# EAGLE design NEW5V (EAGLE 8.5.0)
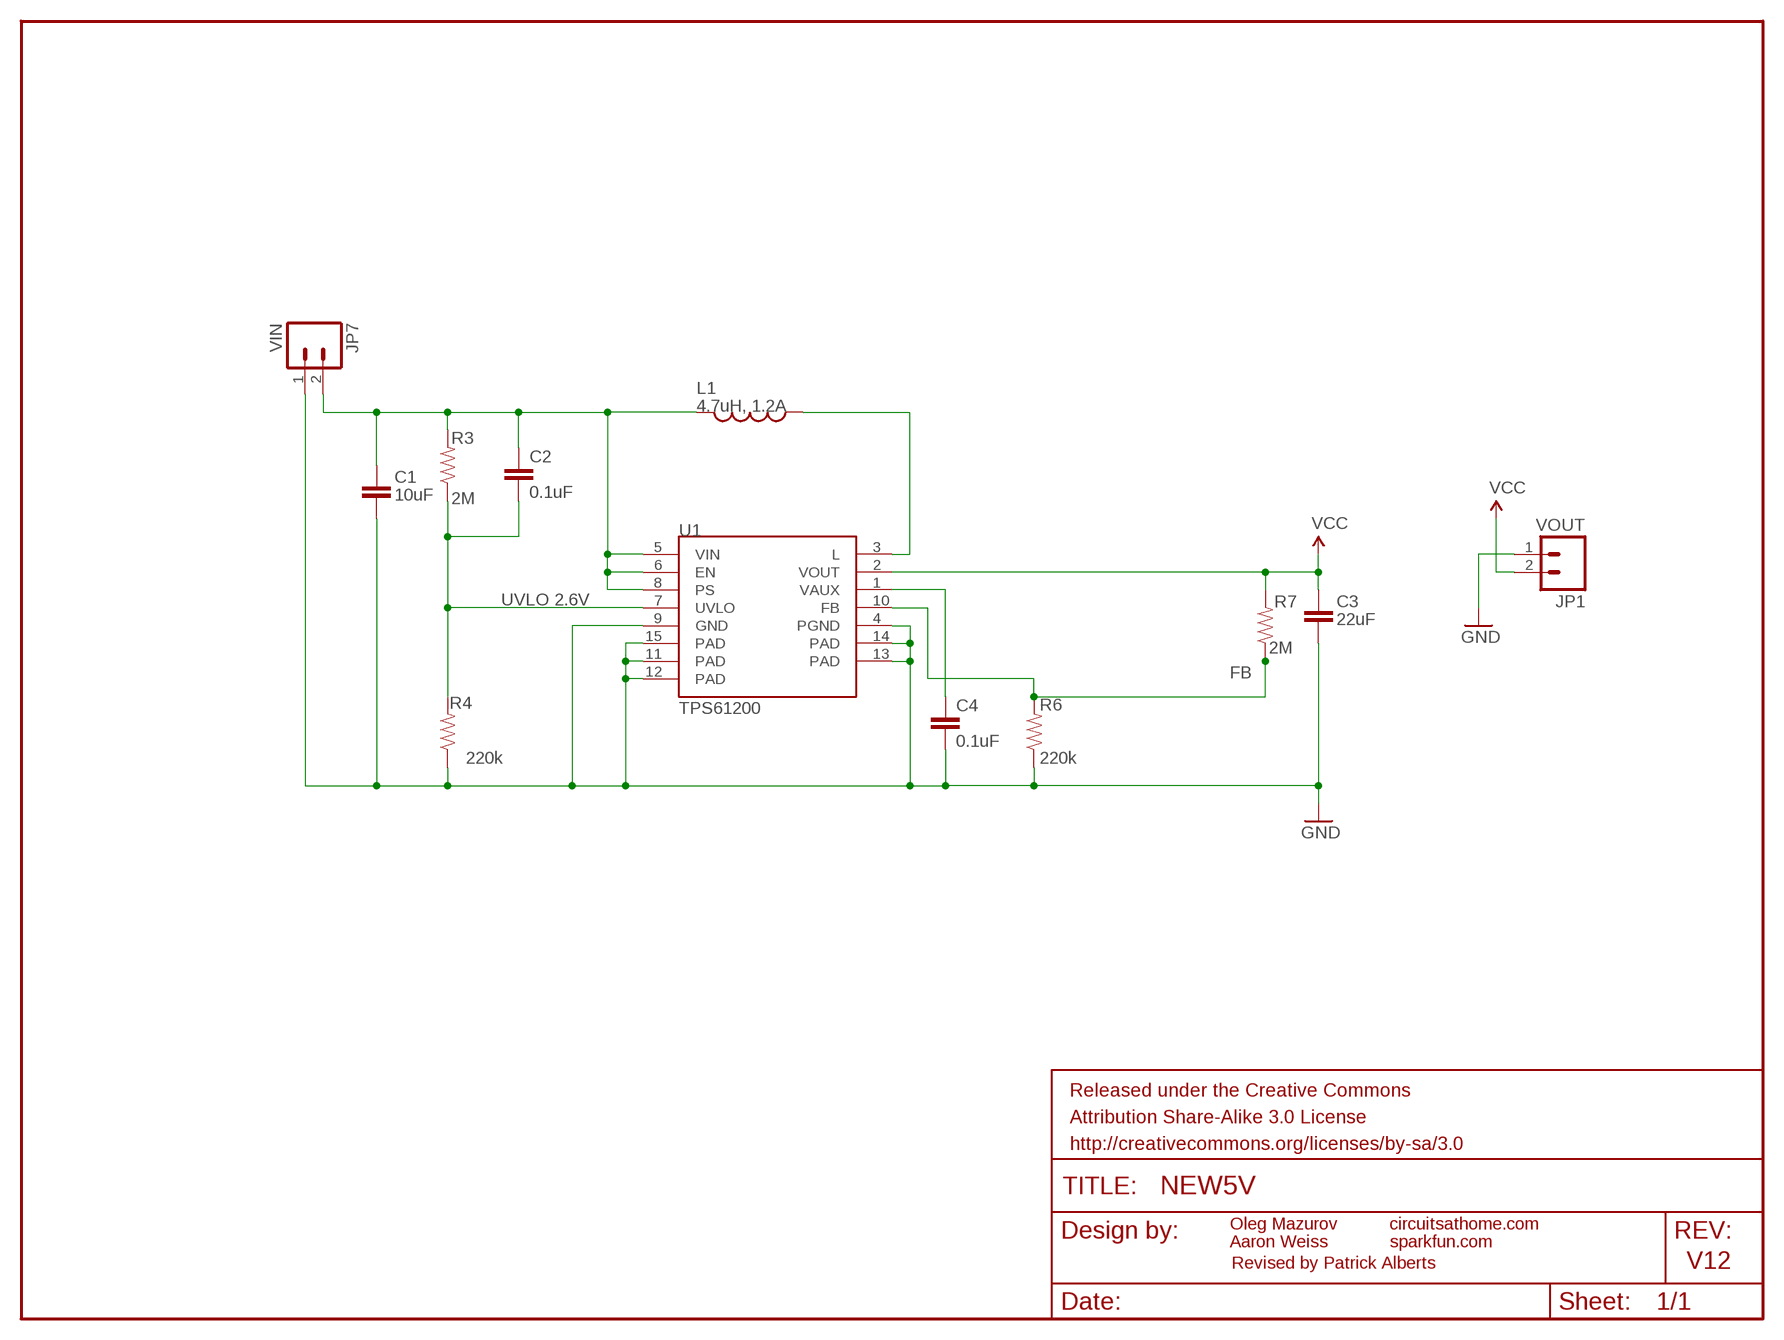
[diagram p0: schematic, sheet 1]

## Parts
C1  10uF  CAP1206  [1206]
C2  0.1uF  CAP0603-CAP  [0603-CAP]
C3  22uF  CAP0805  [0805]
C4  0.1uF  CAP0603-CAP  [0603-CAP]
FRAME1  FRAME-LETTER  [CREATIVE_COMMONS]
JP1  VOUT  M02PTH  [1X02]
JP7  VIN  M02PTH  [1X02]
L1  4.7uH, 1.2A  INDUCTOR.  [CDRH2D09]
R3  2M  RESISTOR0603-RES  [0603-RES]
R4  220k  RESISTOR0603-RES  [0603-RES]
R6  220k  RESISTOR0603-RES  [0603-RES]
R7  2M  RESISTOR0603-RES  [0603-RES]
U1  TPS61200  [QFN-10_PAD]

## Nets
FB: R6.2 R7.1 U1.10(FB)
GND: C1.2 C3.2 C4.2 JP1.1 JP7.1 R4.1 R6.1 U1.4(PGND) U1.9(GND) U1.11(PAD) U1.12(PAD) U1.13(PAD) U1.14(PAD) U1.15(PAD)
N$1: C4.1 U1.1(VAUX)
N$2: L1.P$1 U1.3(L)
UVLO: C2.2 R3.1 R4.2 U1.7(UVLO)
VCC: C3.1 JP1.2 R7.2 U1.2(VOUT)
VIN: C1.1 C2.1 JP7.2 L1.P$2 R3.2 U1.5(VIN) U1.6(EN) U1.8(PS)

## Notes on the sheet
- UVLO 2.6V
- Oleg Mazurov | circuitsathome.com
- Aaron Weiss | sparkfun.com
- Revised by Patrick Alberts | V12

## Library data of the parts
C1 C3 = CH_passive:CAP: Capacitor Standard 0603 ceramic capacitor, and 0.1" leaded capacitor.
C2 C4 = SparkFun:CAP: Capacitor Standard 0603 ceramic capacitor, and 0.1" leaded capacitor.
FRAME1 = SparkFun-Aesthetics:FRAME-LETTER: Schematic Frame Standard 8.5x11 US Letter frame
JP1 JP7 = SparkFun:M02: Header 2 Standard 2-pin 0.1" header. Use with straight break away headers (SKU : PRT-00116), right angle break away headers (PRT-00553), swiss pins (PRT-00743), machine pins (PRT-00117), and female headers (PRT-00115). Molex polarized connector foot print use with SKU : PRT-08233 with associated crimp pins and housings.
L1 = SparkFun:INDUCTOR: Inductors Basic Inductor/Choke - 0603 and 1206. Footprints are not proven and vary greatly between part numbers.
R3 R4 R6 R7 = SparkFun:RESISTOR: Resistor Basic schematic elements and footprints for 0603, 1206, and PTH resistors.
U1 = SparkFun:TPS61200: DC to DC Booster

## Board
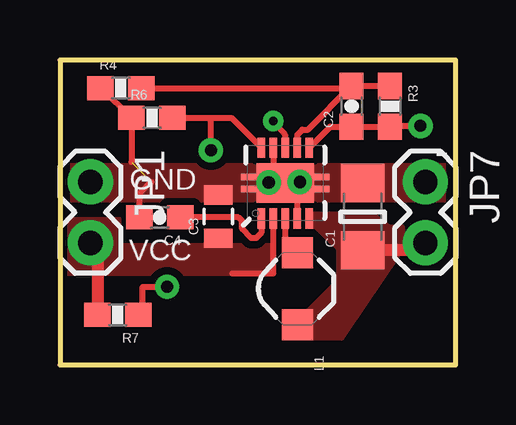
[diagram p1: board, top side]
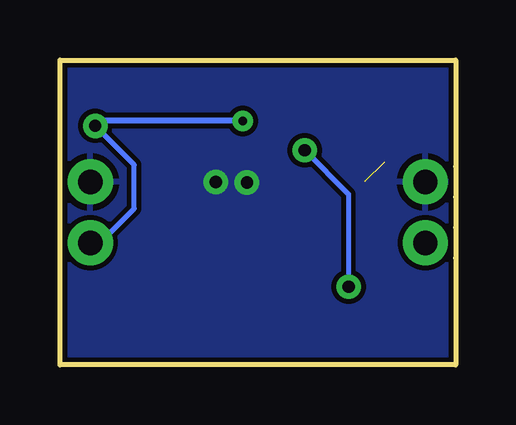
[diagram p2: board, bottom side, seen from below]

Size 16.51 x 12.7 mm. Coordinates in mm from the lower left corner, seen from the top.
Outline: 0,0 16.51,0 16.51,12.7 0,12.7 0,0
Copper layers (1*16): Top 0.035mm / dielectric 1.5mm / Bottom 0.035mm
Design rules "SparkFun *": minimum track width 6mil, minimum drill 10mil, track to track 8mil, track to pad 8mil, pad to pad 8mil, via to via 8mil, smd to smd 8mil, copper to edge 8mil, drill to drill 8mil, minimum pad ring 12mil, minimum via ring 10mil, stop-mask expansion 4mil, vias tented up to drill 20mil, thermal gap 10mil

### Footprints (pad centres in the part's own frame; a part is rotated, then mirrored left to right if it is on the bottom)
1206 = smd 1.6 x 1.8: 1 -1.4,0; 2 1.4,0
0603-CAP = smd 1.1 x 1: 1 -0.85,0; 2 0.85,0
0805 = smd 0.8 x 1.2: 1 -0.9,0; 2 0.9,0
1X02 = drill 1.016 pad 1.88: 1 0,0; 2 2.54,0
CDRH2D09 = smd 1.3 x 1.3: P$1 -1.5,0; P$2 1.5,0
0603-RES = smd 1.1 x 1: 1 -0.85,0; 2 0.85,0
QFN-10_PAD = smd 0.297 x 0.85: 1 -1,-1.475; 2 -0.5,-1.475; 3 0,-1.475; 4 0.5,-1.475; 5 1,-1.475; 6 1,1.475; 7 0.5,1.475; 8 0,1.475; 9 -0.5,1.475; 10 -1,1.475 | smd 0.7 x 0.28: 11 -1.5,0.25; 12 -1.5,-0.25; 13 1.5,0.25; 14 1.5,-0.25 | smd 2.4 x 1.65: 15 0,0

### Placement (x,y rotation side)
C1  12.62,6.17 90 top
C2  12.17,10.77 90 top
C3  6.6,6.17 90 top
C4  4.17,6.15 180 top
FRAME1  21.59,-8.89 0 top  (outside the outline)
JP1  1.27,7.62 270 top
JP7  15.24,7.62 270 top
L1  9.91,3.17 270 top
R3  13.77,10.77 270 top
R4  2.54,11.53 0 top
R6  3.84,10.29 0 top
R7  2.41,2.08 180 top
U1  9.4,7.57 0 top

### Tracks (layer width: path | path; a pad name or v marks a point on that pad's centre or on a via)
FB  (via drill 0.51)
  Top 0.254: U1.10 7.16,10.29 6.35,10.29 | R7.1 3.42,2.23 3.45,2.23 3.45,3.25 v4.47,3.25 | R6.2 6.35,10.29 | v6.3,8.94 6.3,10.24 6.35,10.29
  Bottom 0.203: v4.47,3.25 4.47,7.11 v6.3,8.94
GND  (via drill 0.51)  (1 unrouted)
  Top 0.254: U1.4 9.9,7.36 10.16,7.62 | C4.2 3.32,7.13 3.81,7.62 | 8.89,9.05 U1.9 8.9,8.09 8.89,8.08 8.9,8.07 | R4.1 R6.1 2.98,8.45
  other vias: 8.71,7.59 10.01,7.62
  pour Top (isolate 0.305, no thermals): -0.03,8.31 16.38,8.31 16.38,6.86 0,6.86
  pour Bottom: 0,12.7 0,0 16.51,0 16.51,12.7
N$1
  Top 0.254: 5.07,6.09 C4.1 7.44,6.15 7.59,5.99 7.59,5.66 7.98,5.28 8.18,5.28 8.4,5.5 U1.1
N$2
  Top 0.254: U1.3 9.4,5.16 9.42,5.16 L1.P$1
UVLO
  Top 0.254: C2.2 10.35,9.8 10.11,9.8 9.9,9.59 U1.7 | 11.98,11.43 C2.2 | C2.2 R3.1 | R4.2 12.08,11.53 C2.2
VCC
  Top 0.254: U1.2 8.9,3.82 8.89,3.81 7.18,3.81
  Top 0.508: JP1.2 1.56,4.79 R7.2
  pour Top (isolate 0.305, no thermals): 0,4.95 8.89,4.95 8.89,3.81 0,3.81
  pour Top (no thermals): 2.49,3.81 2.49,6.05 0,6.05 0,3.81
VIN  (via drill 0.35, 0.51)
  Top 0.254: 10.4,8.87 U1.6 11.27,9.92 C2.1 R3.2 13.77,9.96 v15.04,9.96 | U1.8 9.38,9.07 9.38,9.61 8.89,10.09 v8.89,10.16
  Top 0.508: JP7.2 14.93,4.77 C1.1
  Bottom 0.203: v15.04,9.96 13.41,8.33 13.41,6.5 14.83,5.08 JP7.2
  Bottom 0.254: v8.89,10.16 14.83,10.16 v15.04,9.96
  pour Top (isolate 0.305, no thermals): 10.36,1.14 11.76,1.14 14.27,4.85 14.27,5.71 13.72,5.71 13.03,6.25 10.52,6.25 10.39,6.3 10.39,5.79 10.64,5.79 11.63,4.83 11.63,3.51 10.36,2.24

### Text on the board
tPlace: - | GND | VCC
tNames: Oleg Mazurov circuitsathome.com | Aaron Weiss Sparkfun.com